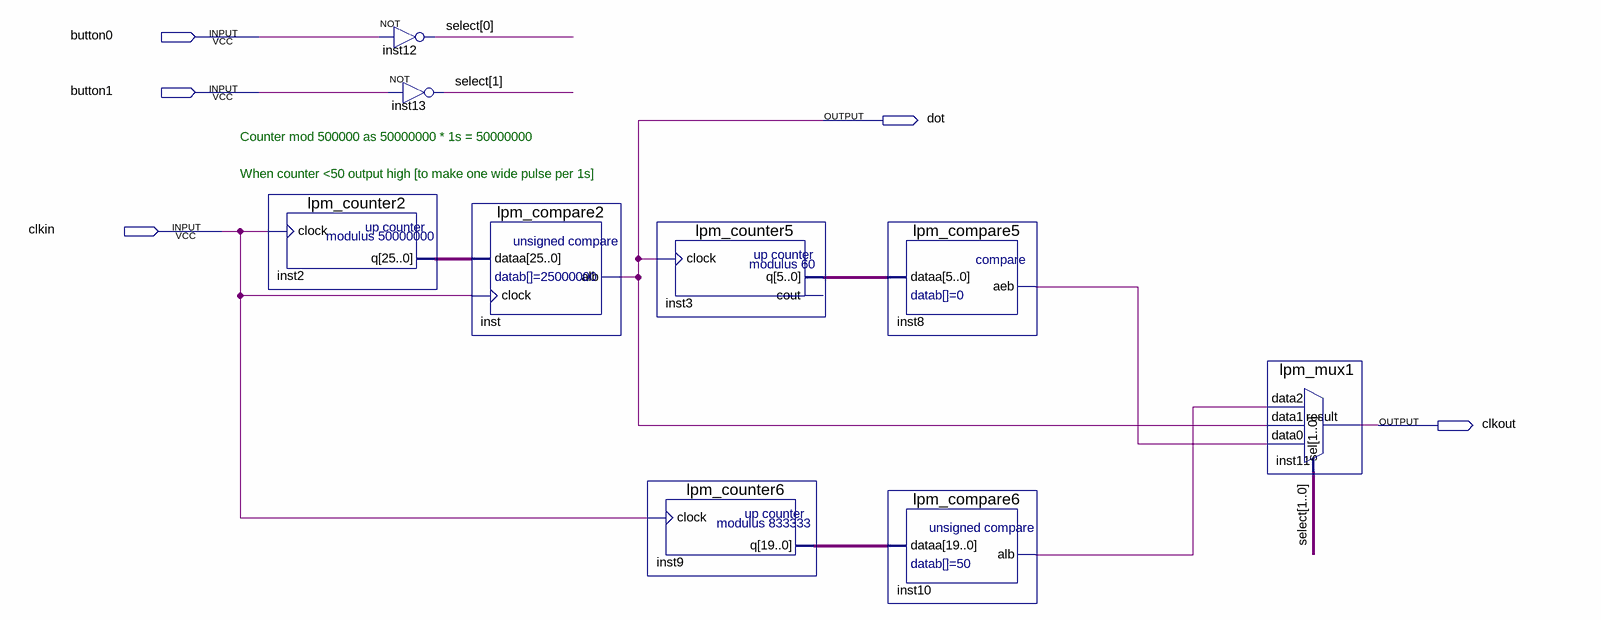
[diagram p0: schematic sheet]
// Quartus schematic digtalclkdivide.bdf as structural Verilog: 9 symbols, 5 pins
module digtalclkdivide (
  input  button0,
  input  button1,
  input  clkin,
  output dot,
  output clkout
);

  wire inst8_aeb, inst10_alb;
  wire [1:0] select;
  wire [5:0] inst3_q;
  wire [19:0] inst9_q;
  wire [25:0] inst2_q;

  lpm_counter2 inst2 (.clock(clkin), .q(inst2_q));
  not inst12 (select[0], button0);
  not inst13 (select[1], button1);
  lpm_compare2 inst (.dataa(inst2_q), .clock(clkin), .alb(dot));
  lpm_counter5 inst3 (.clock(dot), .q(inst3_q));  // open: cout
  lpm_counter6 inst9 (.clock(clkin), .q(inst9_q));
  lpm_compare5 inst8 (.dataa(inst3_q), .aeb(inst8_aeb));
  lpm_compare6 inst10 (.dataa(inst9_q), .alb(inst10_alb));
  lpm_mux1 inst11 (.data2(inst10_alb), .data1(dot), .data0(inst8_aeb), .sel(select), .result(clkout));

  // Notes on the sheet:
  //   Counter mod 500000 as 50000000 * 1s = 50000000
  //   When counter <50 output high [to make one wide pulse per 1s]
endmodule
